# Altium schematic sheet 3.WIZ750SR_ETC.SchDoc
size A4; DrawnBy: Peter; Organization: WIZnet Co., Ltd.; Address1: 5F, Humax Village; Address2: Hwangseaul-ro, Bundang-Gu; Address3: Seongnam-Si, Gyeonggi-Do; Address4: South Korea; Team: Wiki
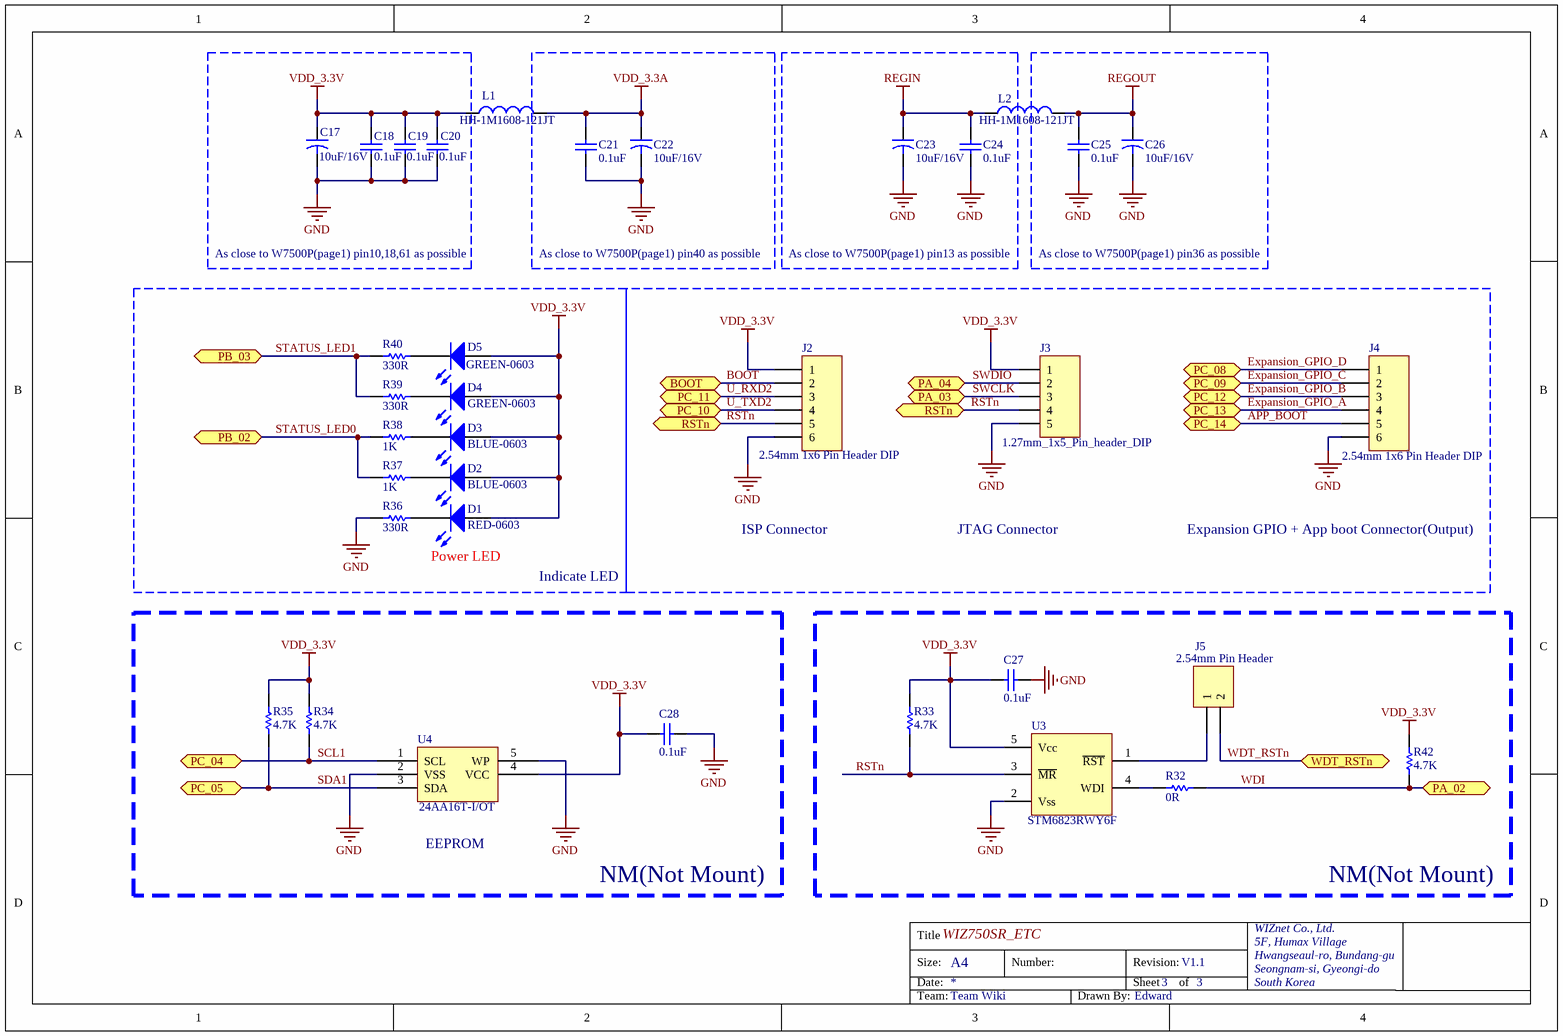
[diagram p0: 3.WIZ750SR_ETC.SchDoc]

## Parts
C17  10uF/16V  [CAP-A Size]
C18  0.1uF  [CAP-0402]
C19  0.1uF  [CAP-0402]
C20  0.1uF  [CAP-0402]
C21  0.1uF  [CAP-0402]
C22  10uF/16V  [CAP-A Size]
C23  10uF/16V  [CAP-A Size]
C24  0.1uF  [CAP-0402]
C25  0.1uF  [CAP-0402]
C26  10uF/16V  [CAP-A Size]
C27  0.1uF  [CAP-0402]
C28  0.1uF  [CAP-0402]
D1  RED-0603  [LED-0603-RED]
D2  BLUE-0603  [LED-0603-BLUE]
D3  BLUE-0603  [LED-0603-BLUE]
D4  GREEN-0603  [LED-0603-GREEN]
D5  GREEN-0603  [LED-0603-GREEN]
J2  2.54mm 1x6 Pin Header DIP  [IDC-1X6]
J3  1.27mm_1x5_Pin_header_DIP  [IDC-1X5(1.27MM)]
J4  2.54mm 1x6 Pin Header DIP  [IDC-1X6]
J5  2.54mm Pin Header  [IDC-1X2]
L1  HH-1M1608-121JT  [IND-0603]
L2  HH-1M1608-121JT  [IND-0603]
R32  0R  [RES-0402]
R33  4.7K  [RES-0402]
R34  4.7K  [RES-0402]
R35  4.7K  [RES-0402]
R36  330R  [RES-0402]
R37  1K  [RES-0402]
R38  1K  [RES-0402]
R39  330R  [RES-0402]
R40  330R  [RES-0402]
R42  4.7K  [RES-0402]
U3  STM6823RWY6F  [SOT-23-5L]
U4  24AA16T-I/OT  [SOT-23-5L]

## Blocks framed on the sheet
As close to W7500P(page1) pin10,18,61 as possible: C17-C20
As close to W7500P(page1) pin40 as possible: C21 C22
As close to W7500P(page1) pin13 as possible: C23 C24
As close to W7500P(page1) pin36 as possible: C25 C26
NM(Not Mount): C28 R34 R35 U4
NM(Not Mount): C27 J5 R32 R33 R42 U3

## Ports
BOOT, PA_02, PA_03, PA_04, PB_02, PB_03, PC_04, PC_05, PC_08, PC_09, PC_10, PC_11, PC_12, PC_13, PC_14, RSTn, WDT_RSTn

## Nets
GND: C17.2 C18.1 C19.1 C20.1 C21.1 C22.2 C23.2 C24.1 C25.1 C26.2 C27.1 C28.1 J2.6 J3.5 J4.6 R36.2 U3.2(Vss) U4.2(VSS) U4.5(WP)
REGIN: C23.1 C24.2 L2.1
REGOUT: C25.2 C26.1 L2.2
VDD_3.3A: C21.2 C22.1 L1.2
VDD_3.3V: C17.1 C18.2 C19.2 C20.2 C27.2 C28.2 D1.1(A) D2.1(A) D3.1(A) D4.1(A) D5.1(A) J2.1 J3.1 L1.1 R33.2 R34.2 R35.2 R42.1 U3.5(Vcc) U4.4(VCC)
APP_BOOT: J4.5 ; port PC_14
BOOT: J2.2 ; port BOOT
Expansion_GPIO_A: J4.4 ; port PC_13
Expansion_GPIO_B: J4.3 ; port PC_12
Expansion_GPIO_C: J4.2 ; port PC_09
Expansion_GPIO_D: J4.1 ; port PC_08
RSTn: J2.5 J3.4 R33.1 U3.3(~{MR}) ; port RSTn
SCL1: R34.1 U4.1(SCL) ; port PC_04
SDA1: R35.1 U4.3(SDA) ; port PC_05
STATUS_LED0: R37.2 R38.2 ; port PB_02
STATUS_LED1: R39.2 R40.2 ; port PB_03
SWCLK: J3.3 ; port PA_03
SWDIO: J3.2 ; port PA_04
U_RXD2: J2.3 ; port PC_11
U_TXD2: J2.4 ; port PC_10
WDI: R32.1 R42.2 ; port PA_02
WDT_RSTn: J5.2 ; port WDT_RSTn
NetD1_2: D1.2(K) R36.1
NetD2_2: D2.2(K) R37.1
NetD3_2: D3.2(K) R38.1
NetD4_2: D4.2(K) R39.1
NetD5_2: D5.2(K) R40.1
NetJ5_1: J5.1 U3.1(~{RST})
NetR32_2: R32.2 U3.4(WDI)

## Notes on the sheet
- Power LED
- Indicate LED
- ISP Connector
- JTAG Connector
- Expansion GPIO + App boot Connector(Output)
- (near U4) EEPROM
- Title
- Size:
- Date:
- WIZ750SR_ETC
- A4
- Number:
- Revision:
- Sheet
- 3
- of
- V1.1
- WIZnet Co., Ltd.
- 5F, Humax Village
- Hwangseaul-ro, Bundang-gu
- Seongnam-si, Gyeongi-do
- South Korea
- Team:
- Team Wiki
- Drawn By:
- Edward

## Library data of the parts
C17 C22 C23 C26 = CAP-A Size: Tantla CAP A Size EIA/IECQ 3216
C18-C21 C24 C25 C27 C28 = CAP-0402: Ceramic CAP 0402(1005)
D1-D5 = LED-0603
J2 J4 = Header 6: Header, 6-Pin; LatestRevisionDate: 17-Jul-2002; LatestRevisionNote: Re-released for DXP Platform.; Publisher: Altium Limited
J5 = Header 2: Header, 2-Pin; LatestRevisionDate: 17-Jul-2002; LatestRevisionNote: Re-released for DXP Platform.; Publisher: Altium Limited
L1 L2 = IND-0603: Inductor 0603(1608)
R32-R40 R42 = RES-0402
U3 = STM6823: Manual_Reset SOT23-5
U4 = 24AAxxT-i-OT: SOT-23